# Altium schematic sheet Sensores.SchDoc
size A4
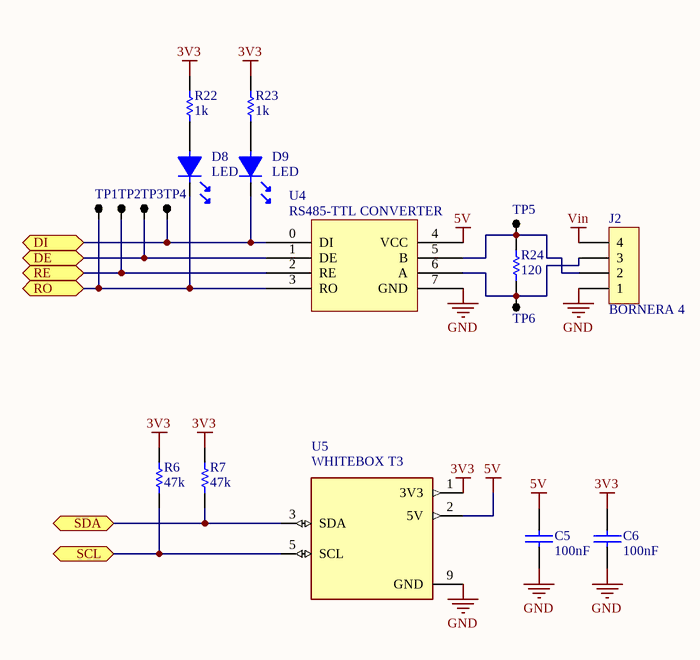
[diagram p0: Sensores.SchDoc]

## Parts
C5  100nF  [0805]
C6  100nF  [0805]
D8  LED  [LED0805]
D9  LED  [LED0805]
J2  BORNERA 4  [BORNERA4]
R6  47k  [0805]
R7  47k  [0805]
R22  1k  [0805]
R23  1k  [0805]
R24  120  [0805]
TP1  TP  [TPSMD]  (value not drawn)
TP2  TP  [TPSMD]  (value not drawn)
TP3  TP  [TPSMD]  (value not drawn)
TP4  TP  [TPSMD]  (value not drawn)
TP5  TP  [TPSMD]  (value not drawn)
TP6  TP  [TPSMD]  (value not drawn)
U4  RS485-TTL CONVERTER  [TTL-RS485 CONVERTER]
U5  WHITEBOX T3  [Whitebox T3 for Raspberry Pi]

## Ports
DE (bidir), DI (bidir), RE (bidir), RO (bidir), SCL (bidir), SDA (bidir)

## Nets
3V3: C6.1 R6.2 R7.2 R22.2 R23.2 U5.1(3V3)
5V: C5.1 U4.4(VCC) U5.2(5V)
GND: C5.2 C6.2 J2.1 U4.7(GND) U5.9(GND)
Vin: J2.4
DE: TP3.1 U4.1(DE) ; port DE
DI: D9.2 TP4.1 U4.0(DI) ; port DI
RE: TP2.1 U4.2(RE) ; port RE
RO: D8.2 TP1.1 U4.3(RO) ; port RO
SCL: R6.1 U5.5(SCL) ; port SCL
SDA: R7.1 U5.3(SDA) ; port SDA
NetD8_1: D8.1 R22.1
NetD9_1: D9.1 R23.1
NetJ2_2: J2.2 R24.2 TP5.1 U4.5(B)
NetJ2_3: J2.3 R24.1 TP6.1 U4.6(A)

## Library data of the parts
C5 C6 = CAP
R6 R7 R22-R24 = RES
U5 = WHITEBOX T3 FOR RASPBERRY PI